# Altium schematic sheet Driver.SchDoc
size Letter
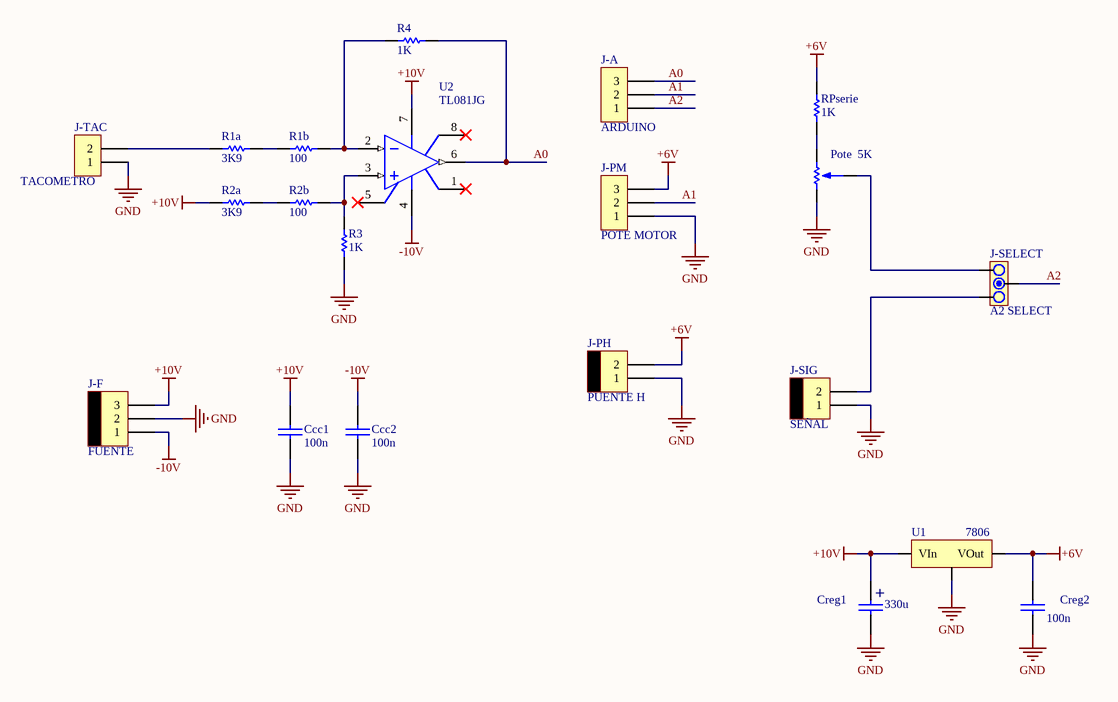
[diagram p0: Driver.SchDoc]

## Parts
Ccc1  100n  [CAP200]
Ccc2  100n  [CAP100]
Creg1  330u  [CAP200RP]
Creg2  100n  [CAP100]
J-A  ARDUINO  [SIP3]
J-F  FUENTE  [MOLEX3]
J-PH  PUENTE H  [MOLEX2]
J-PM  POTE MOTOR  [BORNERA3]
J-SELECT  A2 SELECT  [JUMPER3]
J-SIG  SEÑAL  [MOLEX2]
J-TAC  TACOMETRO  [BORNERA2]
Pote  5K  [POTENCIOMETRO]
R1a  3K9  [RES300]
R1b  100  [RES300]
R2a  3K9  [RES300]
R2b  100  [RES300]
R3  1K  [RES300]
R4  1K  [RES300]
RPserie  1K  [RES300]
U1  7806  [TO-220 V]
U2  TL081JG  [JG008]

## Nets
+6V: Creg2.1 J-PH.2 J-PM.3 RPserie.2 U1.3(VOut)
+10V: Ccc1.1 Creg1.1 J-F.3 R2a.1 U1.1(VIn) U2.7(V+)
-10V: Ccc2.1 J-F.1 U2.4(V-)
GND: Ccc1.2 Ccc2.2 Creg1.2 Creg2.2 J-F.2 J-PH.1 J-PM.1 J-SIG.1 J-TAC.1 Pote.3 R3.1 U1.2(GND)
A0: J-A.3 R4.2 U2.6(OUT)
A1: J-A.2 J-PM.2
A2: J-A.1 J-SELECT.2
NetJ-SELECT_1: J-SELECT.1 J-SIG.2
NetJ-SELECT_3: J-SELECT.3 Pote.2
NetJ-TAC_2: J-TAC.2 R1a.1
NetPote_1: Pote.1 RPserie.1
NetR1a_2: R1a.2 R1b.1
NetR1b_2: R1b.2 R4.1 U2.2(IN-)
NetR2a_2: R2a.2 R2b.1
NetR2b_2: R2b.2 R3.2 U2.3(IN+)

Not connected (* = marked no-connect by the designer): U2 1(OS_TRIM)* 5(OS_TRIM)* 8(NC)*

## Notes on the sheet
- (in symbol CAPPOL) +

## Library data of the parts
Ccc1 Ccc2 Creg2 = CAP
Creg1 = CAPPOL
J-A = CON3
J-F = MOLEX3
J-PH J-SIG = MOLEX2
J-PM = BORNERA 3
J-SELECT = JUMPER3
J-TAC = BORNERA 2
Pote = POTENCIOMETRO
R1a R1b R2a R2b R3 R4 RPserie = RES
U1 = 78XX: REGULDOR POSITIVO
U2 = TL081JG: JFET-Input Operational Amplifier; Note: Pin 8 is not connected; Published: 16-Jan-2001; LatestRevisionDate: 04-Mar-2005; LatestRevisionNote: Stylized 3D Model Added.; DatasheetVersion: Feb-1999; PackageVersion: Jan-1995; PackageReference: JG008; Publisher: Altium Limited; PackageDescription: DIP; 8 Leads; Row Spacing 7.62 mm; Pitch 2.54 mm; ComponentLink1Description: Manufacturer Link; ComponentLink1URL: http://www.ti.com/; ComponentLink2Description: Datasheet; ComponentLink2URL: http://www-s.ti.com/sc/ds/tl081.pdf